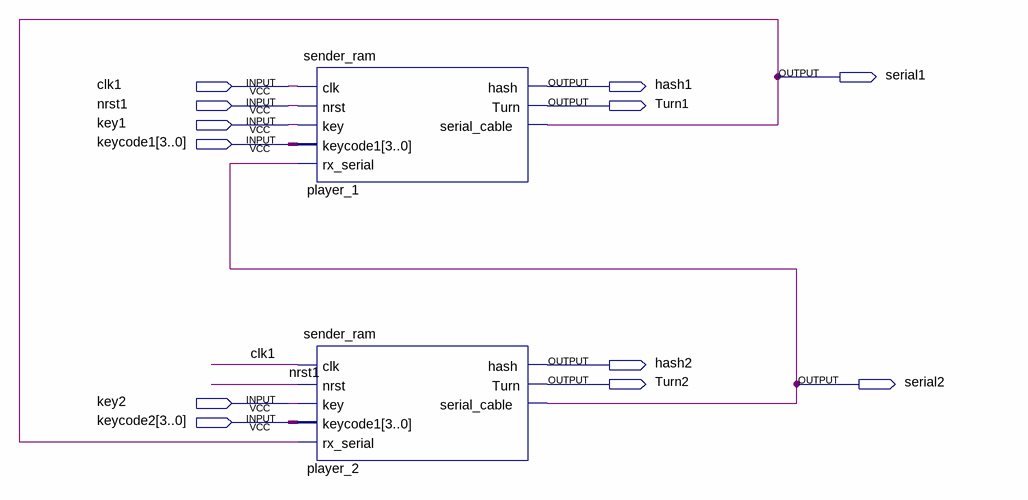
[diagram p0: schematic sheet]
// Quartus schematic bloc_2.bdf as structural Verilog: 2 symbols, 12 pins
module bloc_2 (
  input  clk1,
  input  nrst1,
  input  key1,
  input  [3:0] keycode1,
  input  key2,
  input  [3:0] keycode2,
  output serial1,
  output hash1,
  output Turn1,
  output hash2,
  output Turn2,
  output serial2
);

  sender_ram player_1 (
    .clk(clk1), .nrst(nrst1), .key(key1), .keycode1(keycode1), .rx_serial(serial2), .hash(hash1),
    .Turn(Turn1), .serial_cable(serial1));
  sender_ram player_2 (
    .clk(clk1), .nrst(nrst1), .key(key2), .keycode1(keycode2), .rx_serial(serial1), .hash(hash2),
    .Turn(Turn2), .serial_cable(serial2));
endmodule
